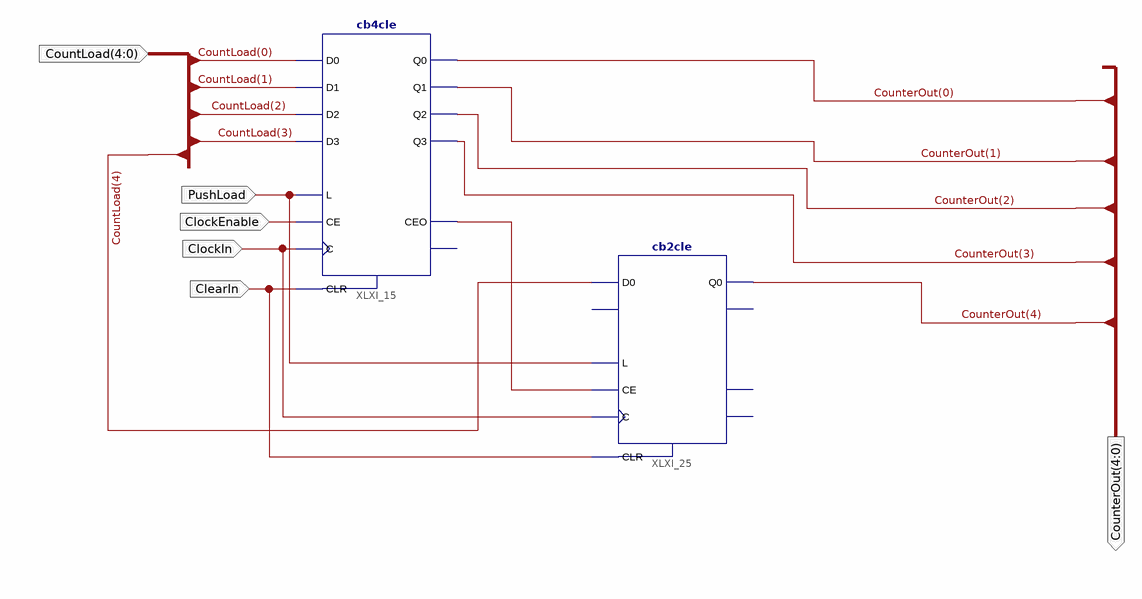
[diagram p0: schematic sheet 1]
// Xilinx ISE schematic ProgramCounter.sch (spartan3e) as structural Verilog: 2 symbols, 6 ports
module ProgramCounter (
  input  ClockIn,
  input  ClearIn,
  input  ClockEnable,
  input  [4:0] CountLoad,
  input  PushLoad,
  output [4:0] CounterOut
);

  wire XLXN_112;

  cb4cle XLXI_15 (
    .C(ClockIn), .CE(ClockEnable), .CLR(ClearIn), .D0(CountLoad[0]), .D1(CountLoad[1]), .D2(CountLoad[2]),
    .D3(CountLoad[3]), .L(PushLoad), .CEO(XLXN_112), .Q0(CounterOut[0]), .Q1(CounterOut[1]),
    .Q2(CounterOut[2]), .Q3(CounterOut[3]));  // open: TC
  cb2cle XLXI_25 (
    .C(ClockIn), .CE(XLXN_112), .CLR(ClearIn), .D0(CountLoad[4]), .L(PushLoad), .Q0(CounterOut[4]));  // open: D1, CEO, Q1, TC
endmodule
